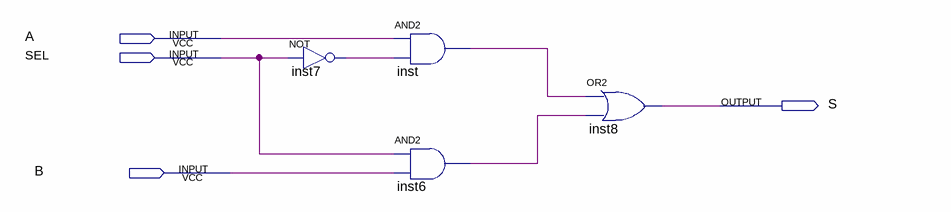
[diagram p0: schematic sheet]
// Quartus schematic MUX21.bdf as structural Verilog: 4 symbols, 4 pins
module MUX21 (
  input  A,
  input  SEL,
  input  B,
  output S
);

  wire inst6_out, inst7_out, inst_out;

  not inst7 (inst7_out, SEL);
  and inst (inst_out, A, inst7_out);
  and inst6 (inst6_out, SEL, B);
  or inst8 (S, inst_out, inst6_out);
endmodule
